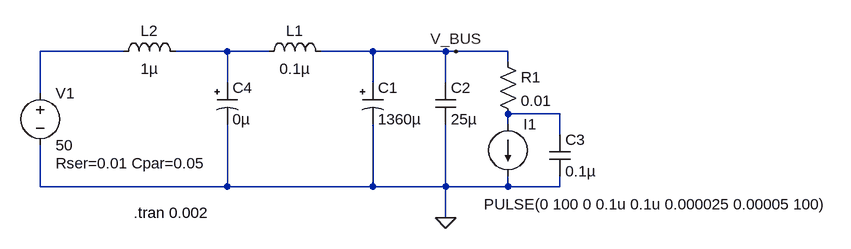
[diagram p0: schematic sim_caps.asc]
sim_caps.asc, the LTspice schematic file:
Version 4
SHEET 1 1212 680
WIRE -112 256 -240 256
WIRE 48 256 -32 256
WIRE 112 256 48 256
WIRE 272 256 192 256
WIRE 384 256 272 256
WIRE 400 256 384 256
WIRE 480 256 400 256
WIRE 480 272 480 256
WIRE 48 304 48 256
WIRE 272 304 272 256
WIRE 384 304 384 256
WIRE -240 320 -240 256
WIRE 560 352 480 352
WIRE 480 368 480 352
WIRE 560 384 560 352
WIRE -240 464 -240 400
WIRE 48 464 48 368
WIRE 48 464 -240 464
WIRE 272 464 272 368
WIRE 272 464 48 464
WIRE 384 464 384 368
WIRE 384 464 272 464
WIRE 480 464 480 448
WIRE 480 464 384 464
WIRE 560 464 560 448
WIRE 560 464 480 464
WIRE 384 512 384 464
FLAG 384 512 0
FLAG 400 256 V_BUS
SYMBOL ind -128 272 R270
WINDOW 0 32 56 VTop 2
WINDOW 3 5 56 VBottom 2
SYMATTR InstName L2
SYMATTR Value 1µ
SYMATTR SpiceLine Rser=0.01
SYMBOL polcap 256 304 R0
WINDOW 3 24 56 Left 2
SYMATTR Value 1360µ
SYMATTR InstName C1
SYMATTR Description Capacitor
SYMATTR Type cap
SYMATTR SpiceLine V=100 Irms=0 Rser=0.01 Lser=0.01u
SYMBOL voltage -240 304 R0
WINDOW 123 0 0 Left 2
WINDOW 39 24 124 Left 2
SYMATTR SpiceLine Rser=0.01 Cpar=0.05
SYMATTR InstName V1
SYMATTR Value 50
SYMBOL current 480 368 R0
WINDOW 123 0 0 Left 2
WINDOW 39 0 0 Left 2
WINDOW 3 -37 123 Left 2
SYMATTR Value PULSE(0 100 0 0.1u 0.1u 0.000025 0.00005 100)
SYMATTR InstName I1
SYMBOL cap 368 304 R0
SYMATTR InstName C2
SYMATTR Value 25µ
SYMATTR SpiceLine V=85 Rser=0.0002 Lser=0.001u
SYMBOL res 464 256 R0
SYMATTR InstName R1
SYMATTR Value 0.01
SYMBOL cap 544 384 R0
SYMATTR InstName C3
SYMATTR Value 0.1µ
SYMBOL ind 96 272 R270
WINDOW 0 32 56 VTop 2
WINDOW 3 5 56 VBottom 2
SYMATTR InstName L1
SYMATTR Value 0.1µ
SYMATTR SpiceLine Rser=0.001
SYMBOL polcap 32 304 R0
WINDOW 3 24 56 Left 2
SYMATTR Value 0µ
SYMATTR InstName C4
SYMATTR Description Capacitor
SYMATTR Type cap
SYMATTR SpiceLine V=100 Irms=0 Rser=0.002 Lser=0.01u
TEXT -96 504 Left 2 !.tran 0.002

The netlist it stands for:
* sim_caps.asc
L2 N001 N002 1µ Rser=0.01
C1 V_BUS 0 1360µ V=100 Irms=0 Rser=0.01 Lser=0.01u
V1 N001 0 50 Rser=0.01 Cpar=0.05
I1 N003 0 PULSE(0 100 0 0.1u 0.1u 0.000025 0.00005 100)
C2 V_BUS 0 25µ V=85 Rser=0.0002 Lser=0.001u
R1 V_BUS N003 0.01
C3 N003 0 0.1µ
L1 N002 V_BUS 0.1µ Rser=0.001
C4 N002 0 0µ V=100 Irms=0 Rser=0.002 Lser=0.01u
.tran 0.002
.backanno
.end